# EasyEDA Pro project 2.8_pcb_src.eprj, board PCB1
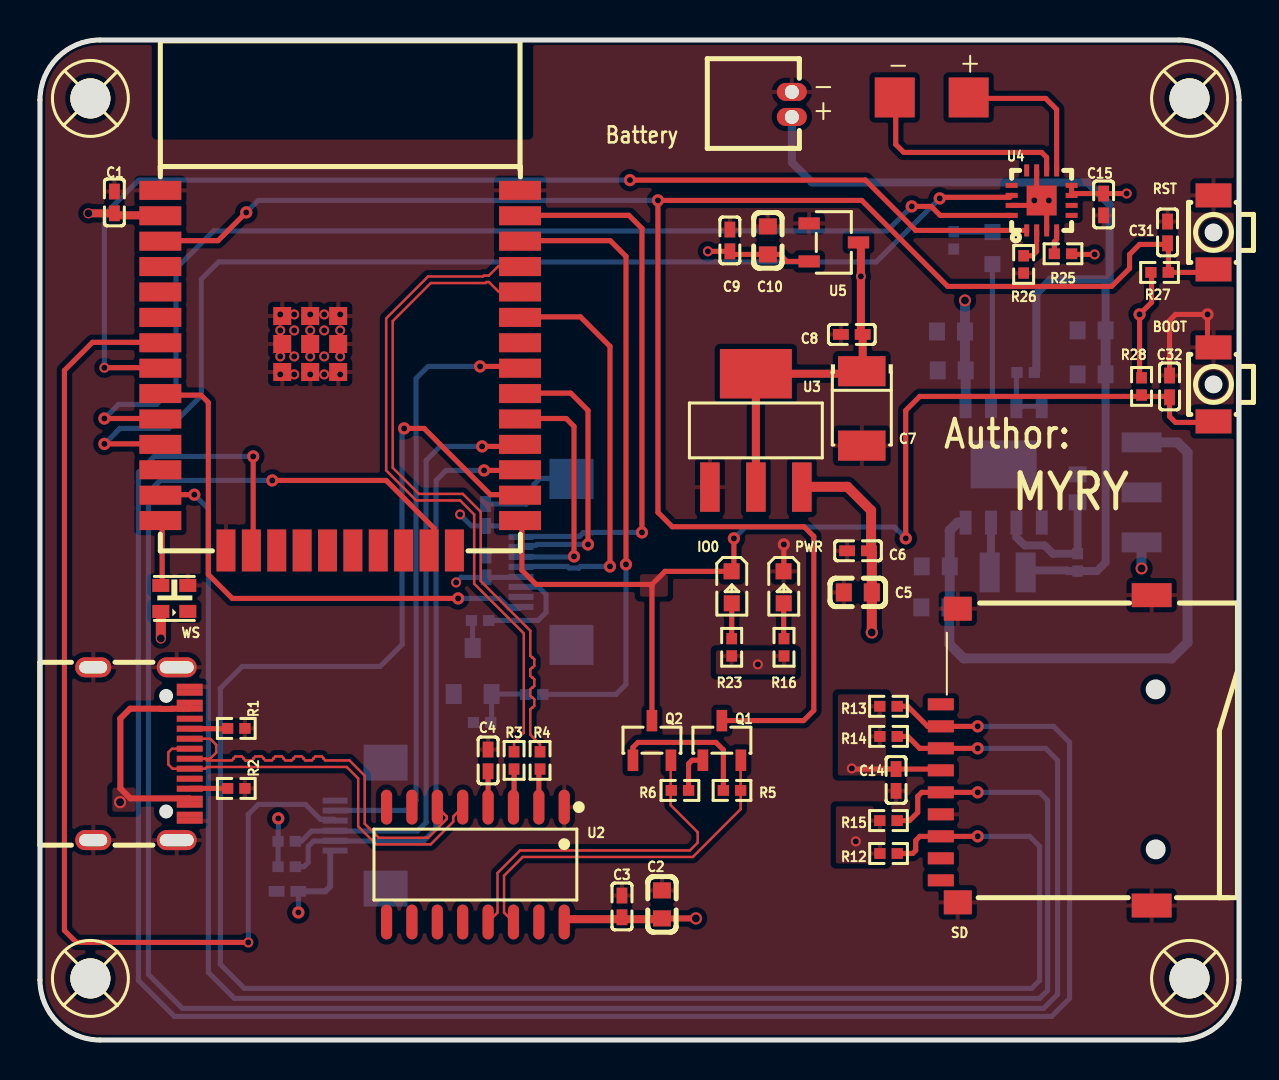
[diagram p2: board, top side]
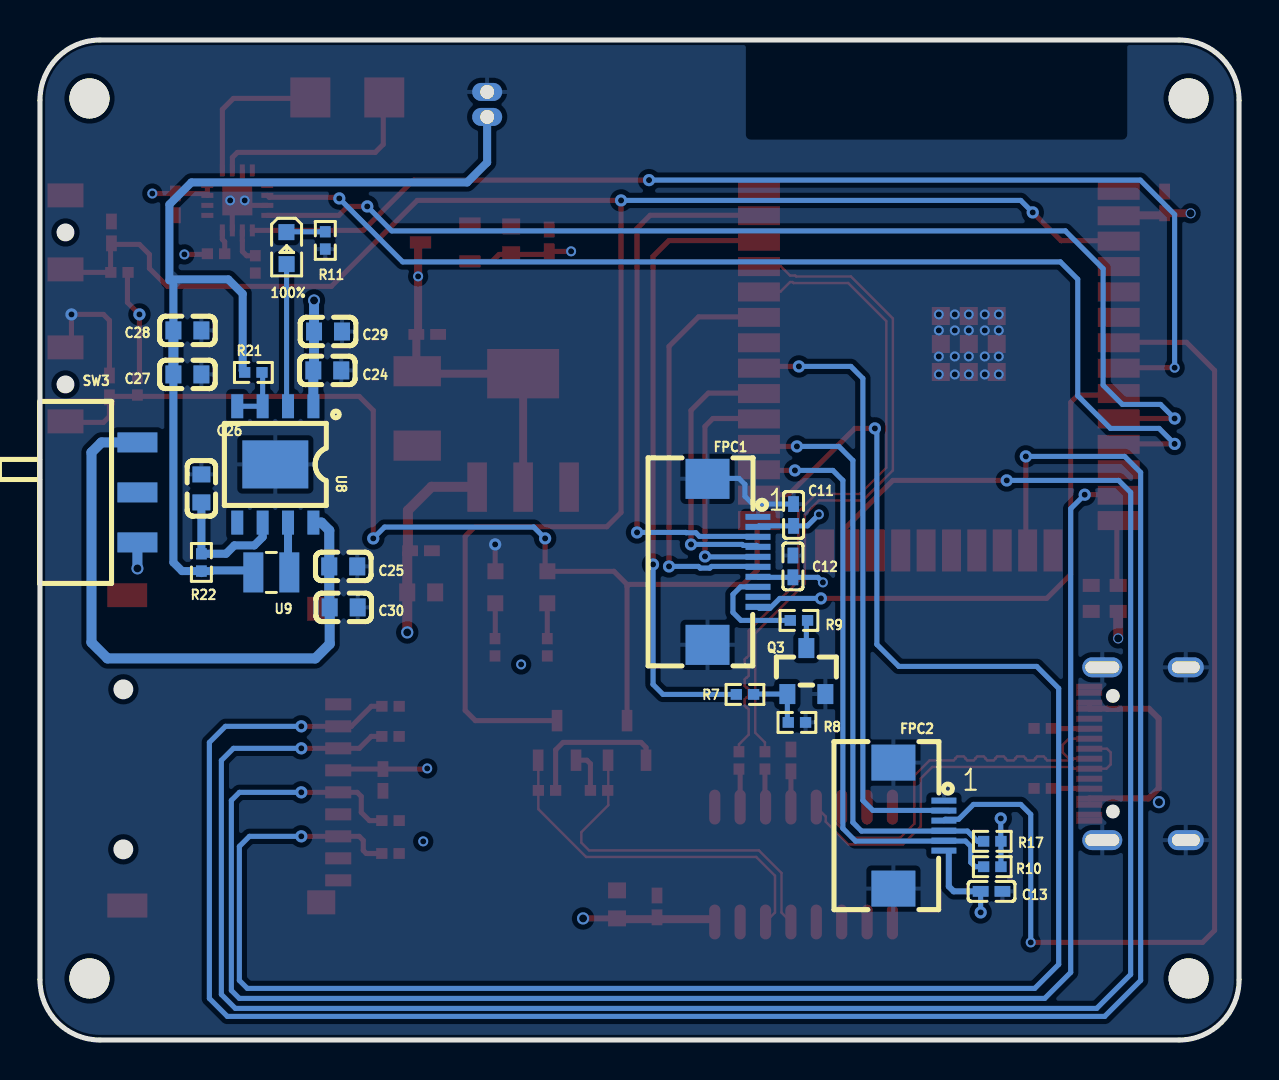
[diagram p3: board, bottom side, seen from below]

Outline 60 x 50 mm; copper layers: Top Layer, GND, PWR, Bottom Layer. Coordinates in mm from the lower left corner of the outline.
Outline path: 0,47 0,3 arc(0.88,0.88) 3,0 57,0 arc(59.12,0.88) 60,3 60,47 arc(59.12,49.12) 57,50 3,50 arc(0.88,49.12) 0,47
Stack: Top Layer 0.035mm Outer layer copper thickness 1oz / Dielectric1 0.2104mm 7628 RC49% 8.6mil / GND 0.0152mm Inner layer copper thickness / Dielectric2 1.065mm 1.1mm H/HOZ Copper / PWR 0.0152mm Inner layer copper thickness / Dielectric3 0.2104mm 7628 RC49% 8.6mil / Bottom Layer 0.035mm Outer layer copper thickness 1oz

## Design rules (mm)
net RTS: DP2
net DTR: DP2
net TX0: DP3
net RX0: DP3
net USB_DP: DP1
net USB_DN: DP1
template: Custom Config
spacing copperThickness1oz (default): track to track 0.102, other pairs 0.152 to 0.3
spacing copperThickness2oz: track to track 0.203, other pairs 0.152 to 0.3
track width copperThickness1oz (default): min 0.127, default 0.254, max 2.54
track width copperThickness2oz: min 0.203, default 0.254, max 2.54
differential pair differentialPair (default): width min 0.124, default 0.124, max 0.124; gap min 0.203, default 0.203
via viaSize (default): diameter min 0.5, default 0.61, max 10; hole min 0.3, default 0.305, max 6.3

## Placement (name value [footprint] x y rotation side)
100%  XL-1608SURC-06  [LED0603-RD_RED]  47.66 39.59 270 bottom
Battery  ZX-MX1.25-2PWZ  [CONN-TH_2P-P1.25_ZX-MX1.25-2PWZ]  37.62 46.78 270 top
BOOT  TS-1063S-B3D4  [KEY-SMD_L3.0-W2.5-LS4.0_TS-1603S]  58.72 32.78 90 top
C1  100nF  [C0402]  3.72 41.88 270 top
C2  10uF  [C0603]  31.12 6.78 270 top
C3  100nF  [C0402]  29.12 6.68 90 top
C4  100nF  [C0402]  22.42 13.98 270 top
C5  10uF  [C0603]  40.92 22.38 0 top
C6  100nF  [C0402]  40.93 24.46 180 top
C7  100uF  [CASE-B_3528]  41.12 31.58 270 top
C8  100nF  [C0402]  40.62 35.28 0 top
C9  100nF  [C0402]  34.52 39.98 270 top
C10  47uF  [C0603]  36.42 39.98 270 top
C11  100nF  [C0402]  22.29 26.25 90 bottom
C12  100nF  [C0402]  22.32 23.68 90 bottom
C13  100nF  [C0402]  12.38 7.43 180 bottom
C14  100nF  [C0402]  42.84 13 270 top
C15  100nF  [C0402]  53.22 41.78 270 top
C24  10uF  [C0603]  45.62 33.48 180 bottom
C25  10uF  [C0603]  44.82 23.68 180 bottom
C26  22uF  [C0603]  51.92 27.58 270 bottom
C27  22uF  [C0603]  52.62 33.28 180 bottom
C28  22uF  [C0603]  52.62 35.48 180 bottom
C29  22uF  [C0603]  45.59 35.43 0 bottom
C30  22uF  [C0603]  44.8 21.63 0 bottom
C31  100nF  [C0402]  56.42 40.38 270 top
C32  100nF  [C0402]  56.52 32.68 270 top
FPC1  0.5K-DX-10PWBG  [FPC-SMD_10P-P0.50_HDGC_0.5K-DX-10PWBG]  25.33 23.91 270 bottom
FPC2  0.5K-DX-6PWBG  [FPC-SMD_6P-P0.50_DEALON_0.5K-DX-6PWB]  16.03 10.72 270 bottom
IO0  XL-1608SURC-06  [LED0603-RD_RED]  34.61 22.64 270 top
PWR  XL-1608SURC-06  [LED0603-RD_RED]  37.21 22.64 270 top
Q1  S8050  [SOT-23-3_L2.9-W1.3-P1.90-LS2.3-BR]  34.12 14.98 270 top
Q2  S8050  [SOT-23-3_L2.9-W1.3-P1.90-LS2.3-BR]  30.62 14.98 270 top
Q3  Si2302CDS-T1-GE3  [SOT-23_L2.9-W1.3-P1.90-LS2.4-BR]  21.65 18.45 270 bottom
R1  5.1K  [R0402]  9.82 15.58 180 top
R2  5.1K  [R0402]  9.82 12.58 0 top
R3  5.1K  [R0402]  23.72 13.98 90 top
R4  5.1K  [R0402]  25.02 13.98 90 top
R5  12K  [R0402]  32.02 12.48 0 top
R6  12K  [R0402]  34.63 12.48 180 top
R7  1K  [R0402]  24.72 17.28 180 bottom
R8  10K  [R0402]  22.12 15.88 180 bottom
R9  10  [R0402]  22.02 20.98 0 bottom
R10  4.7K  [R0402]  12.35 8.66 0 bottom
R11  2K  [R0402]  45.72 39.98 90 bottom
R12  10K  [R0402]  42.46 9.33 180 top
R13  10K  [R0402]  42.46 16.69 180 top
R14  10K  [R0402]  42.46 15.18 180 top
R15  10K  [R0402]  42.46 10.97 180 top
R16  470  [R0402]  37.23 19.64 90 top
R17  4.7K  [R0402]  12.35 9.94 0 bottom
R21  1K  [R0402]  49.32 33.38 180 bottom
R22  1K  [R0402]  51.92 23.88 270 bottom
R23  470  [R0402]  34.61 19.64 90 top
R25  1M  [R0402]  51.19 39.31 0 top
R26  220  [R0402]  49.22 38.78 270 top
R27  10K  [R0402]  56.02 38.38 180 top
R28  10K  [R0402]  55.12 32.68 90 top
RST  TS-1063S-B3D4  [KEY-SMD_L3.0-W2.5-LS4.0_TS-1603S]  58.72 40.38 90 top
SCREW1  -  [Screw-Hole-M2]  2.52 3.08 0 top
SCREW2  -  [Screw-Hole-M2]  57.52 3.08 0 top
SCREW3  -  [Screw-Hole-M2]  2.52 47.08 0 top
SCREW4  -  [Screw-Hole-M2]  57.52 47.08 0 top
SD  TF-01A  [TF-SMD_TF-01A]  50.35 14.48 90 top
SW3  SK-3245S-L1-A  [SW-SMD_SK-3245S-L1-A-1]  55.12 27.38 90 bottom
TP1  -  [Test-Point-0.5mm]  42.77 47.13 0 top
TP2  -  [Test-Point-0.5mm]  46.47 47.13 0 top
U2  CH340C  [SOP-16_L10.0-W3.9-P1.27-LS6.0-BL]  21.79 8.77 180 top
U3  AMS1117-3.3  [SOT-223-4_L6.5-W3.5-P2.30-LS7.0-BR]  35.82 30.48 270 top
U4  MAX98357AETE+T  [TQFN-16_L3.0-W3.0-P0.50-BL-EP1.5]  50.12 41.98 0 top
U5  XC6206-2.8V  [SOT-23-3_L2.9-W1.6-P1.90-LS2.8-BR]  39.72 39.88 180 top
U8  IP5306  [ESOP-8_L4.9-W3.9-P1.27-LS6.0-BL-EP]  48.22 28.78 0 bottom
U9  1uH  [IND-SMD_L2.5-W2.0_YXNAQ252010-3R3M]  48.42 23.38 180 bottom
U11  ESP32-WROOM-32E-N16  [WIFI-SMD_ESP32-WROOM-32E]  15.02 33.48 270 top
USB1  KH-TYPE-C-16P  [USB-C-SMD_KH-TYPE-C-16P]  5.08 14.31 270 top
WS  XL-2020RGBC-WS2812B  [LED-SMD_4P-L2.0-W2.0-BR-1]  6.72 22.08 0 top

## Footprints (pads in the part's own frame, mm; a bottom-side part is the same pattern mirrored in y, then rotated)
C0402
  rect 0.79x0.54 smd: 1(-0.545,0) 2(0.545,0)
C0603
  rect 0.8x0.9 smd: 1(-0.7,0) 2(0.7,0)
CASE-B_3528
  rect 1.506x2.376 smd: 1(-1.861,0) 2(1.861,0)
CONN-TH_2P-P1.25_ZX-MX1.25-2PWZ
  oval 0.9x1.5 hole 0.7: 1(0.625,0) 2(-0.625,0)
ESOP-8_L4.9-W3.9-P1.27-LS6.0-BL-EP
  rect 0.6x1.2 smd: 1(-1.905,-2.909) 2(-0.635,-2.909) 3(0.635,-2.909) 4(1.905,-2.909) 5(1.905,2.909) 6(0.635,2.909) 7(-0.635,2.909) 8(-1.905,2.909)
  rect 3.3x2.4 smd: 9(0,0)
FPC-SMD_6P-P0.50_DEALON_0.5K-DX-6PWB
  rect 0.3x1.25 smd: 1(-1.25,1.262) 2(-0.75,1.262) 3(-0.25,1.262) 4(0.25,1.262) 5(0.75,1.262) 6(1.25,1.262)
  rect 1.8x2.2 smd: 7(3.15,-1.262) 8(-3.15,-1.262)
FPC-SMD_10P-P0.50_HDGC_0.5K-DX-10PWBG
  rect 0.3x1.25 smd: 1(-2.25,1.262) 2(-1.75,1.262) 3(-1.25,1.262) 4(-0.75,1.262) 5(-0.25,1.262) 6(0.25,1.262) 7(0.75,1.262) 8(1.25,1.262) 9(1.75,1.262) 10(2.25,1.262)
  rect 2x2.2 smd: 11(4.15,-1.262) 12(-4.15,-1.262)
IND-SMD_L2.5-W2.0_YXNAQ252010-3R3M
  rect 1x2 smd: 1(0.9,0) 2(-0.9,0)
KEY-SMD_L3.0-W2.5-LS4.0_TS-1603S
  rect 1.2x1.8 smd: 1(-1.85,0) 2(1.85,0)
LED0603-RD_RED
  rect 0.8x0.8 smd: 1(-0.799,-0.004) 2(0.799,0.004)
LED-SMD_4P-L2.0-W2.0-BR-1
  rect 0.85x0.65 smd: 1(0.675,-0.65) 2(0.675,0.65) 3(-0.675,0.65) 4(-0.675,-0.65)
R0402
  rect 0.566x0.54 smd: 1(-0.433,0) 2(0.433,0)
Screw-Hole-M2
  round 2 hole 2: 1(0,0)
SOP-16_L10.0-W3.9-P1.27-LS6.0-BL
  oval 0.56x1.745 smd: 1(-4.445,-2.873) 2(-3.175,-2.873) 3(-1.905,-2.873) 4(-0.635,-2.873) 5(0.635,-2.873) 6(1.905,-2.873) 7(3.175,-2.873) 8(4.445,-2.873) 9(4.445,2.873) 10(3.175,2.873) 11(1.905,2.873) 12(0.635,2.873) 13(-0.635,2.873) 14(-1.905,2.873) 15(-3.175,2.873) 16(-4.445,2.873)
SOT-23-3_L2.9-W1.3-P1.90-LS2.3-BR
  rect 1.07x0.532 smd: 1(0.99,-0.95) 2(0.99,0.95) 3(-0.99,0)
SOT-23-3_L2.9-W1.6-P1.90-LS2.8-BR
  rect 1.07x0.6 smd: 1(1.235,-0.95) 2(1.235,0.95) 3(-1.235,0)
SOT-23_L2.9-W1.3-P1.90-LS2.4-BR
  rect 1x0.8 smd: 1(1.15,-0.95) 2(1.15,0.95) 3(-1.15,0)
SOT-223-4_L6.5-W3.5-P2.30-LS7.0-BR
  rect 2.47x0.98 smd: 1(2.835,-2.3) 2(2.835,0) 3(2.835,2.3)
  rect 2.47x3.6 smd: 4(-2.835,0)
SW-SMD_SK-3245S-L1-A-1
  rect 1x2 smd: 1(-2.5,0) 2(0,0) 3(2.5,0)
Test-Point-0.5mm
  rect 2x2 smd: 1(0,0)
TF-SMD_TF-01A
  rect 0.6x1.3 smd: 1(2.3,5.276) 2(1.2,5.276) 3(0.101,5.276) 4(-1,5.276) 5(-2.099,5.276) 6(-3.2,5.276) 7(-4.3,5.276) 8(-5.399,5.276) 9(-6.5,5.276)
  rect 1.2x1.4 smd: 10(-7.599,4.426) 13(7.08,4.426)
  rect 1.2x2 smd: 11(-7.76,-5.276) 12(7.76,-5.276)
TQFN-16_L3.0-W3.0-P0.50-BL-EP1.5
  rect 0.25x0.6 smd: 1(-0.749,-1.5) 2(-0.248,-1.5) 3(0.252,-1.5) 4(0.751,-1.5) 9(0.75,1.5) 10(0.25,1.5) 11(-0.25,1.5) 12(-0.749,1.5)
  rect 0.6x0.25 smd: 5(1.5,-0.748) 6(1.5,-0.248) 7(1.5,0.252) 8(1.5,0.752) 13(-1.5,0.752) 14(-1.5,0.252) 15(-1.5,-0.248) 16(-1.5,-0.748)
  rect 1.5x1.5 smd: 17(0,0)
USB-C-SMD_KH-TYPE-C-16P
  oval 1x2 hole 0.6x1.7: 1(-4.32,1.765) 2(4.32,1.765)
  oval 1x1.8 hole 0.6x1.4: 3(-4.32,-2.415) 4(4.32,-2.415)
  rect 0.3x1.3 smd: A1(-3.35,2.415) A4(-2.55,2.415) A5(-1.25,2.415) A6(-0.25,2.415) A7(0.25,2.415) A8(1.25,2.415) A9(2.55,2.415) A12(3.35,2.415) B1(3.05,2.415) B4(2.25,2.415) B5(1.75,2.415) B6(0.75,2.415) B7(-0.75,2.415) B8(-1.75,2.415) B9(-2.25,2.415) B12(-3.05,2.415)
WIFI-SMD_ESP32-WROOM-32E
  rect 0.95x2.1 smd: 1(-9.002,-9) 2(-7.732,-9) 3(-6.463,-9) 4(-5.192,-9) 5(-3.922,-9) 6(-2.652,-9) 7(-1.383,-9) 8(-0.113,-9) 9(1.157,-9) 10(2.428,-9) 11(3.697,-9) 12(4.968,-9) 13(6.237,-9) 14(7.508,-9) 25(7.508,9) 26(6.237,9) 27(4.968,9) 28(3.697,9) 29(2.428,9) 30(1.157,9) 31(-0.113,9) 32(-1.383,9) 33(-2.652,9) 34(-3.922,9) 35(-5.192,9) 36(-6.463,9) 37(-7.732,9) 38(-9.002,9)
  rect 2.1x0.95 smd: 15(9.002,-5.715) 16(9.002,-4.445) 17(9.002,-3.175) 18(9.002,-1.905) 19(9.002,-0.635) 20(9.002,0.635) 21(9.002,1.905) 22(9.002,3.175) 23(9.002,4.445) 24(9.002,5.715)
  rect 0.9x0.9 smd: 39(-2.721,-0.1) 39(-2.721,-1.5) 39(-2.721,-2.9) 39(-1.321,-0.1) 39(-1.321,-1.5) 39(-1.321,-2.9) 39(0.079,-0.1) 39(0.079,-1.5) 39(0.079,-2.9)

## Nets
2.8V: C9.2 C10.2 C11.1 FPC1.2 U5.2
3V3: C1.2 C7.1 C8.2 C12.1 C13.1 C14.1 C15.1 FPC1.7 FPC2.6 R10.1 R12.2 R13.2 R14.2 R15.2 R16.1 R17.1 R23.1 R25.2 R27.2 R28.2 SD.4 U3.2 U3.4 U4.7 U4.8 U5.3 U11.2
5V: C2.2 C3.1 C5.2 C6.1 SW3.1 U2.16 U3.3 WS.4
GND: Battery.2 BOOT.2 C1.1 C2.1 C3.2 C4.1 C5.1 C6.2 C7.2 C8.1 C9.1 C10.1 C11.2 C12.2 C13.2 C14.2 C15.2 C24.2 C25.2 C26.1 C27.2 C28.2 C29.1 C30.1 C31.1 C32.1 FPC1.1 FPC1.11 FPC1.12 FPC2.1 FPC2.7 FPC2.8 PWR.1 Q3.2 R1.1 R2.2 R8.2 R11.1 R26.2 RST.2 SD.6 SD.10 SD.11 SD.12 SD.13 U2.1 U3.1 U4.3 U4.11 U4.15 U4.17 U5.1 U8.9 U11.1 U11.15 U11.38 U11.39 USB1.1 USB1.2 USB1.3 USB1.4 USB1.A1 USB1.A12 USB1.B1 USB1.B12 WS.2
BAT: Battery.1 C27.1 C28.1 R21.1 R22.2 U9.2
DTR: Q2.2 R5.1 U2.13
EN: C31.2 Q1.3 R27.1 RST.1 U11.3
IO0: BOOT.1 C32.2 IO0.1 Q2.3 R28.1 U11.25
IO4_SD_MISO: R12.1 SD.7 U11.26
IO5_LCD_CS: FPC1.5 U11.29
IO12_WS: U11.14 WS.3
IO13_SD_CS: R13.1 SD.2 U11.16
IO14_SD_SCK: R15.1 SD.5 U11.13
IO15_SD_MOSI: R14.1 SD.3 U11.23
IO16_TP_SCL: FPC2.5 R10.2 U11.27
IO17_TP_SDA: FPC2.4 R17.2 U11.28
IO18_LCD_SCK: FPC1.4 U11.30
IO19_TP_RST: FPC2.2 U11.31
IO22_LCD_BLK: R7.1 U11.36
IO23_LCD_MOSI: FPC1.3 U11.37
IO25_I2S_CLK: U4.16 U11.10
IO26_I2S_LRCLK: U4.14 U11.11
IO32_I2S_DIN: U4.1 U11.8
IO32_LCD_RS: FPC1.10 U11.9
IO33_LCD_RST: FPC1.6 U11.33
IO35_TP_INT: FPC2.3 U11.7
LEDK: FPC1.8 R9.2
RTS: Q1.2 R6.1 U2.14
RX0: R4.2 U11.34
TX0: R3.2 U11.35
USB_5V: C24.1 C29.2 U8.1 USB1.A4 USB1.A9 USB1.B4 USB1.B9
USB_DN: U2.6 USB1.A7 USB1.B7
USB_DP: U2.5 USB1.A6 USB1.B6
$1N3140: 100%.2 U8.2
$1N3141: 100%.1 R11.2
$1N3143: R21.2 U8.3 U8.4
$1N3146: C25.1 C30.2 SW3.3 U8.8
$1N3149: U8.7 U9.1
$1N3152: C26.2 R22.1 U8.6
$1N3676: R1.2 USB1.A5
$1N3681: R2.1 USB1.B5
$1N4120: R4.1 U2.2
$1N4125: R3.1 U2.3
$1N4154: C4.2 U2.4
$1N4327: Q1.1 R5.2
$1N4331: Q2.1 R6.2
$1N5555: Q3.1 R7.2 R8.1
$1N5650: Q3.3 R9.1
$1N6795: TP1.1 U4.10
$1N6801: TP2.1 U4.9
$1N6935: IO0.2 R23.2
$1N6977: PWR.2 R16.2
$1N11841: R25.1 U4.4
$1N11888: R26.1 U4.2

Pads without a net: FPC1 9; SCREW1 1; SCREW2 1; SCREW3 1; SCREW4 1; SD 1 8 9; SW3 2; U2 7 8 9 10 11 12 15; U4 5 6 12 13; U8 5; U11 4 5 6 12 17 18 19 20 21 22 24 32; USB1 A8 B8; WS 1

## Via types
v1: diameter 0.5, hole 0.305, Top Layer to Bottom Layer, 32 vias
v2: diameter 0.61, hole 0.305, Top Layer to Bottom Layer, 31 vias
v3: diameter 0.5, hole 0.4, Top Layer to Bottom Layer, 2 vias
v4: diameter 0.61, hole 0.4, Top Layer to Bottom Layer, 3 vias
v5: diameter 0.6, hole 0.4, Top Layer to Bottom Layer, 2 vias
v6: diameter 0.5, hole 0.3, Top Layer to Bottom Layer, 1 via

## Routing (per net, layer and track width the routed paths; a pad name or vN(x,y) marks a point on that pad's centre or on a via; arc(x,y) is an arc through that point)
2.8V: length 33.7
  Top Layer w0.254: U5.2 37.37,38.93 37.02,39.28 C10.2 34.68,39.28 C9.2 v1(33.42,39.43)
  PWR w0.254: v6(21.02,26.28) 21.02,38.68 21.78,39.43 v1(33.42,39.43)
  Bottom Layer w0.254: v6(21.02,26.28) 21.6,25.71 C11.1 24.02,25.71 FPC1.2
3V3: length 237.6
  Top Layer w0.254: R27.2 55.62,38.35 55.62,36.88 v2(55.02,36.28) 55.02,33.21 R28.2 ; v1(54.38,42.32) C15.1 51.72,42.32 U4.7 U4.8 ; v1(52.77,39.28) 51.66,39.28 ; SD.4 45.01,13.55 C14.1 40.65,13.55 v1(40.62,13.58)
  Top Layer w0.4: U3.2 U3.4 41,33.31 C7.1 41.17,33.48 C8.2 41.08,35.37 v1(41.08,38.18) 41.08,39.76 U5.3 ; v3(2.42,41.33) C1.2 3.82,41.23 6.11,41.23
  PWR w0.254: v1(52.77,39.28) 53.72,39.28 54.38,39.93 v1(54.38,42.32) ; v1(35.92,18.78) 35.92,37.48 36.62,38.18 v1(41.08,38.18) 43.02,38.18 45.32,35.88 54.62,35.88 v2(55.02,36.28) 55.02,41.68 v1(54.38,42.32) ; v1(35.92,18.78) 35.92,14.48 36.82,13.58 v1(40.62,13.58) ; v1(35.92,18.78) 35.82,18.68 33.22,18.68 32.72,19.18 32.72,21.88 31.72,22.88 v1(20.82,22.88) 13.92,22.88 11.92,20.88 v2(11.92,11.08) ; v2(11.92,11.08) 10.22,11.08 9.62,10.48 9.62,7.18 10.42,6.38 v2(12.93,6.38) ; v2(11.92,11.08) 39.67,11.08 v1(40.82,9.93) ; v3(2.42,41.33) 2.42,43.18 3.32,44.08 53.62,44.08 54.42,43.28 54.42,42.37 v1(54.38,42.32)
  Bottom Layer w0.254: FPC1.7 24.05,23.13 C12.1 21.08,23.13 v1(20.82,22.88) ; v2(11.92,11.08) 11.92,9.94 R17.1 R10.1 ; C13.1 v2(12.93,6.38)
  Bottom Layer w0.3: C13.1 14.28,7.43 14.52,7.68 14.52,9.44 14.51,9.45
5V: length 106.3
  Top Layer w0.3: C2.2 v4(32.82,6.08)
  Top Layer w0.4: 31.12,6.04 26.37,6.04 U2.16
  Top Layer w0.5: v4(41.62,20.38) C5.2 41.62,24.32 C6.1 41.59,24.57 41.59,26.48 40.41,27.66 38.14,27.66 U3.3 ; WS.4 v3(6.05,20.08)
  PWR w0.5: v3(6.05,20.08) 4.92,18.95 4.92,3.48 6.02,2.38 31.52,2.38 32.82,3.68 v4(32.82,6.08) 39.82,6.08 41.62,7.88 v4(41.62,20.38) 54.72,20.38 55.12,20.78 v5(55.12,23.58)
  Bottom Layer w0.5: SW3.1 v5(55.12,23.58)
GND: length 17.6
  Top Layer w0.254: v2(37.22,24.78) 37.22,23.45 PWR.1 ; C32.1 56.52,35.98 56.82,36.28 v2(58.42,36.28) 58.42,34.93 BOOT.2 ; U4.15 49.51,41.73 v1(49.76,41.98) ; U4.11 49.87,42.59 v1(50.48,41.98) 50.37,41.87 U4.3
  Bottom Layer w0.254: C11.2 24.34,26.8 24.72,27.18 24.72,27.78 25.02,28.08 26.58,28.08 26.6,28.06
  vias: v1(12.02,36.28) v1(12.02,35.48) v1(12.02,34.18) v1(12.02,33.28) v1(12.72,36.28) v1(12.72,35.48) v1(12.72,34.18) v1(12.72,33.28) v1(13.52,36.28) v1(13.52,35.48) v1(13.52,34.18) v1(13.52,33.28) v1(14.22,36.28) v1(14.22,35.48) v1(14.22,34.18) v1(14.22,33.28) v1(15.02,36.28) v1(15.02,35.48) v1(15.02,34.18) v1(15.02,33.28)
BAT: length 49
  Bottom Layer w0.4: R21.1 49.86,33.48 49.86,37.31 50.57,38.03 53.48,38.03 53.52,37.98 53.52,41.78 52.42,42.88 38.62,42.88 37.62,43.88 Battery.1 ; 53.32,37.89 C28.1 ; C27.1 53.32,23.88 52.89,23.45 R22.2 ; 51.87,23.4 51.92,23.35 ; 51.82,23.45 51.42,23.45 51.39,23.48 49.42,23.48 U9.2
  Bottom Layer w0.5: C28.1 C27.1
DTR: length 18
  Top Layer w0.124: U2.13 22.89,6.37 22.89,8.35 24.02,9.48 32.52,9.48 32.91,9.87 32.91,10.39 31.56,11.74 31.56,13.98 Q2.2
EN: length 95.4
  Top Layer w0.254: 6.11,39.97 8.91,39.97 v2(10.32,41.38) ; 58.82,38.53 58.67,38.38 56.47,38.38 56.47,39.73 56.42,39.78 55.02,39.78 54.52,39.28 54.52,38.58 53.62,37.68 45.42,37.68 41.12,41.98 v2(30.92,41.98) 30.92,26.38 31.64,25.66 38.24,25.66 38.72,25.18 38.72,16.48 38.21,15.97 Q1.3
  Bottom Layer w0.254: v2(10.32,41.38) 10.92,41.98 v2(30.92,41.98)
IO0: length 54.4
  Top Layer w0.254: v2(43.32,25.08) 43.32,31.48 44.02,32.18 56.48,32.18 C32.2 56.52,31.18 56.82,30.88 58.67,30.88 BOOT.1 ; v2(34.72,25.08) 34.72,23.55 IO0.1 31.28,23.43 30.62,22.78 30.62,22.68 ; 30.62,22.68 30.52,22.78 24.82,22.78 24.11,23.49 24.11,26 ; 30.62,22.68 Q2.3
  Bottom Layer w0.254: v2(43.32,25.08) 42.76,25.65 35.29,25.65 v2(34.72,25.08)
IO4_SD_MISO: length 98.3
  Top Layer w0.254: v2(18.22,30.58) 19.22,30.58 22.54,27.27 24.11,27.27 ; v2(46.92,10.18) SD.7 44.03,10.18 43.82,9.98 43.82,9.48 43.67,9.33 R12.1
  Bottom Layer w0.254: v2(18.22,30.58) 18.12,30.48 18.12,19.78 17.02,18.68 10.12,18.68 9.02,17.58 9.02,3.78 10.22,2.58 49.62,2.58 50.02,2.98 50.02,9.68 49.52,10.18 v2(46.92,10.18)
IO5_LCD_CS: length 11.9
  Top Layer w0.254: v2(26.72,24.18) 26.72,30.68 26.33,31.08 24.11,31.08
  Bottom Layer w0.254: v2(26.72,24.18) 26.7,24.16 FPC1.5
IO12_WS: length 3.3
  Top Layer w0.254: 5.95,22.73 6.11,22.89 6.11,26
IO13_SD_CS: length 106.1
  Top Layer w0.254: R13.1 43.42,16.69 44.42,15.68 SD.2 v2(46.92,15.68) ; v2(10.67,29.18) 10.67,24.47
  Bottom Layer w0.254: v2(46.92,15.68) 50.72,15.68 51.52,14.88 51.52,2.08 50.62,1.18 6.72,1.18 4.92,2.98 4.92,28.38 5.72,29.18 v2(10.67,29.18)
IO14_SD_SCK: length 86.7
  Top Layer w0.254: v2(46.92,12.38) SD.5 44.13,12.38 43.92,12.18 43.92,11.38 43.51,10.97 R15.1 ; 6.11,27.27 v2(7.72,27.27)
  Bottom Layer w0.254: v2(7.72,27.27) 8.42,26.56 8.42,3.38 9.72,2.08 50.02,2.08 50.42,2.48 50.42,11.98 50.02,12.38 v2(46.92,12.38)
IO15_SD_MOSI: length 107.5
  Top Layer w0.254: R14.1 43.42,15.18 44.02,14.58 SD.3 v2(46.92,14.58) ; 19.56,24.47 19.72,24.64 19.72,25.58 17.32,27.98 v2(11.62,27.98)
  Bottom Layer w0.254: v2(46.92,14.58) 50.32,14.58 50.92,13.98 50.92,2.28 50.22,1.58 7.12,1.58 5.42,3.28 5.42,27.38 6.02,27.98 v2(11.62,27.98)
IO16_TP_SCL: length 30.2
  Top Layer w0.254: 24.11,28.53 24.06,28.48 v2(22.22,28.48)
  Bottom Layer w0.254: R10.2 13.21,8.66 13.42,8.88 13.42,9.68 13.69,9.95 19.19,9.95 19.82,10.58 19.82,27.98 20.32,28.48 v2(22.22,28.48)
IO17_TP_SDA: length 30.2
  Top Layer w0.254: v2(22.12,29.68) 23.99,29.68 24.11,29.8
  Bottom Layer w0.254: R17.2 13.08,9.94 13.59,10.45 18.89,10.45 19.32,10.88 19.32,28.98 20.02,29.68 v2(22.12,29.68)
IO18_LCD_SCK: length 13.8
  Top Layer w0.254: v2(27.42,24.78) 27.42,31.48 26.56,32.34 24.11,32.34
  Bottom Layer w0.254: FPC1.4 24.14,24.73 24.81,24.73 24.86,24.78 v2(27.42,24.78)
IO19_TP_RST: length 31.2
  Top Layer w0.254: v2(22.02,33.68) 24.05,33.68 24.11,33.61
  Bottom Layer w0.254: v2(22.02,33.68) 19.42,33.68 18.82,33.08 18.82,11.98 18.32,11.48 14.55,11.48 14.51,11.45
IO22_LCD_BLK: length 31.3
  Top Layer w0.254: 24.11,39.97 28.54,39.97 29.32,39.18 v2(29.32,23.78)
  Bottom Layer w0.254: R7.1 28.82,17.28 29.32,17.78 v2(29.32,23.78)
IO23_LCD_MOSI: length 27.6
  Top Layer w0.254: 24.11,41.23 29.47,41.23 30.12,40.58 v2(30.12,25.38)
  Bottom Layer w0.254: v2(30.12,25.38) 27.68,25.38 27.67,25.36 27.18,25.36 27,25.18 24.09,25.18 FPC1.3
IO25_I2S_CLK: length 56.3
  Top Layer w0.254: v2(43.62,41.68) 44.6,41.68 45.05,41.23 U4.16 ; 6.11,31.08 v2(3.22,31.08)
  Bottom Layer w0.254: v2(43.62,41.68) 42.4,40.45 8.69,40.45 6.8,38.57 6.8,32.74 5.84,31.78 3.93,31.78 v2(3.22,31.08)
IO26_I2S_LRCLK: length 56.8
  Top Layer w0.254: 6.11,29.8 v2(3.22,29.8) ; U4.14 48.53,42.14 45.08,42.14 v2(45.02,42.08)
  Bottom Layer w0.254: v2(3.22,29.8) 4,30.58 6.43,30.58 8.07,32.22 8.07,38.04 8.94,38.91 41.85,38.91 v2(45.02,42.08)
IO32_I2S_DIN: length 58.5
  Top Layer w0.254: 6.11,33.61 v1(3.22,33.61) ; U4.1 43.82,40.48 41.31,43 v2(29.52,43)
  Bottom Layer w0.254: v2(29.52,43) 4.94,43 3.22,41.28 v1(3.22,33.61)
IO32_LCD_RS: length 27.5
  Top Layer w0.254: v2(20.92,22.08) 9.62,22.08 8.42,23.28 8.42,31.88 8.06,32.25 6.21,32.25 6.11,32.34
  Bottom Layer w0.254: FPC1.10 23.99,21.58 23.48,21.58 22.98,22.08 v2(20.92,22.08)
IO33_LCD_RST: length 20.6
  Top Layer w0.254: 24.11,36.16 27.05,36.16 28.52,34.68 v2(28.52,23.68)
  Bottom Layer w0.254: FPC1.6 24.09,23.68 26.4,23.68 26.48,23.59 26.96,23.59 27.05,23.68 v2(28.52,23.68)
IO35_TP_INT: length 54.2
  Top Layer w0.254: 6.11,34.89 2.63,34.89 1.22,33.48 1.22,5.48 1.82,4.88 v1(10.42,4.88)
  Bottom Layer w0.254: FPC2.3 14.7,11.04 14.03,11.04 13.29,11.78 10.92,11.78 10.42,11.28 v1(10.42,4.88)
LEDK: length 5.3
  Bottom Layer w0.254: R9.2 24.92,20.98 25.32,21.38 25.32,22.28 24.94,22.66 FPC1.8
RTS: length 18.2
  Top Layer w0.124: Q1.2 35.06,13.98 R6.1 35.06,11.54 32.67,9.15 24.16,9.15 23.22,8.22 23.22,6.37 U2.14
RX0: length 33.9
  Top Layer w0.124: 24.11,37.42 22.94,37.42 22.47,37.9 22.34,37.9 22.29,37.85 19.55,37.85 17.65,35.94 17.65,28.61 18.96,27.31 21.16,27.31 22.05,26.41 22.05,22.95 24.54,20.47 24.54,19.21 24.62,19.12 24.65,19.12 24.74,19.03 24.74,18.71 24.65,18.62 24.62,18.62 24.54,18.53 24.54,18.21 24.62,18.12 24.65,18.12 24.74,18.03 24.74,17.71 24.65,17.62 24.62,17.62 24.54,17.53 24.54,17.21 24.62,17.12 24.65,17.12 24.74,17.03 24.74,16.71 24.65,16.62 24.62,16.62 24.54,16.53 24.54,15.27 25.02,14.78 R4.2
TX0: length 33.9
  Top Layer w0.124: 24.11,38.69 22.94,38.69 22.47,38.22 22.21,38.22 22.16,38.17 19.42,38.17 17.32,36.08 17.32,28.48 18.82,26.98 21.02,26.98 21.73,26.28 21.73,22.81 24.21,20.33 24.21,15.37 23.72,14.88 R3.2
USB_5V: length 89.7
  Top Layer w0.254: USB1.A4 USB1.B9
  Top Layer w0.3: USB1.B9 6.59,16.56 6.58,16.55 6.04,16.55 6.03,16.56 4.51,16.56 4.02,16.08 4.02,12.58 4.52,12.08 7.48,12.08 USB1.B4
  PWR w0.5: v5(46.29,36.98) 46.29,39.88 45.79,40.38 5.12,40.38 4.01,39.26 v4(4.01,11.89)
  Bottom Layer w0.5: U8.1 46.32,31.69 C24.1 46.29,33.52 C29.2 v5(46.29,36.98)
USB_DN: length 20.6
  Top Layer w0.124: U2.6 20.35,11.17 20.35,11.05 19.41,10.11 16.95,10.11 16.25,10.81 16.25,13.21 15.49,13.98 14.28,13.98 14.19,14.07 14.19,14.09 14.1,14.18 13.78,14.18 13.69,14.09 13.69,14.07 13.6,13.98 13.28,13.98 13.19,14.07 13.19,14.09 13.1,14.18 12.78,14.18 12.69,14.09 12.69,14.07 12.6,13.98 12.28,13.98 12.19,14.07 12.19,14.09 12.1,14.18 11.78,14.18 11.69,14.09 11.69,14.07 11.6,13.98 11.28,13.98 11.19,14.07 11.19,14.09 11.1,14.18 10.78,14.18 10.69,14.09 10.69,14.07 10.6,13.98 10.28,13.98 10.19,14.07 10.19,14.09 10.1,14.18 9.78,14.18 9.69,14.09 9.69,14.07 9.6,13.98 8.35,13.98 8.27,14.06 ; USB1.B7 8.51,15.06 8.82,14.75 8.82,14.38 8.51,14.06 8.27,14.06 ; 8.27,14.06 USB1.A7
USB_DP: length 20.5
  Top Layer w0.124: U2.5 20.68,11.17 20.68,10.91 19.55,9.78 16.82,9.78 15.92,10.68 15.92,13.08 15.35,13.65 8.35,13.65 8.27,13.56 USB1.B6 6.64,13.56 6.42,13.78 6.42,14.38 6.61,14.56 USB1.A6
$1N3140: length 7.1
  Bottom Layer w0.254: U8.2 47.66,31.76 100%.2
$1N3141: length 2
  Bottom Layer w0.254: R11.2 47.65,40.41 100%.1
$1N3143: length 3.1
  Bottom Layer w0.254: 48.99,33.38 48.92,33.38 48.86,33.31 U8.3 U8.4
$1N3146: length 31.3
  Bottom Layer w0.5: U8.8 45.91,25.87 45.52,25.48 C25.1 45.52,21.65 C30.2 45.5,19.8 46.22,19.08 56.62,19.08 57.42,19.88 57.42,29.38 56.92,29.88 55.32,29.88 55.12,30.08
$1N3149: length 2.5
  Bottom Layer w0.4: U9.1 47.59,23.44 U8.7
$1N3152: length 6.7
  Bottom Layer w0.4: U8.6 48.86,25.14 49.27,24.73 50.27,24.73 50.69,24.31 R22.1 C26.2
$1N3676: length 1.9
  Top Layer w0.254: R1.2 9.38,15.56 USB1.A5
$1N3681: length 1.9
  Top Layer w0.254: USB1.B5 7.51,12.58 R2.1
$1N4120: length 1.9
  Top Layer w0.254: 24.92,13.55 24.96,13.51 U2.2
$1N4125: length 1.9
  Top Layer w0.254: U2.3 23.72,11.68 R3.1
$1N4154: length 1.8
  Top Layer w0.254: C4.2 U2.4
$1N4327: length 2.1
  Top Layer w0.254: Q1.1 32.63,13.99 32.46,13.81 R5.2
$1N4331: length 7.4
  Top Layer w0.254: Q2.1 29.67,14.63 29.92,14.88 33.82,14.88 34.2,14.51 R6.2
$1N5555: length 3.1
  Bottom Layer w0.254: R7.2 24.27,17.3 Q3.1 22.6,15.92 R8.1
$1N5650: length 1.4
  Bottom Layer w0.254: R9.1 21.65,20.92 Q3.3
$1N6795: length 10.8
  Top Layer w0.254: U4.10 50.37,44.13 50.12,44.38 43.22,44.38 42.82,44.78 42.82,47.08
$1N6801: length 7.6
  Top Layer w0.254: U4.9 50.87,46.53 50.32,47.08 46.52,47.08
$1N6935: length 1.8
  Top Layer w0.254: 34.61,20.07 34.62,20.07 IO0.2
$1N6977: length 1.8
  Top Layer w0.254: PWR.2 37.22,20.08 37.23,20.07
$1N11841: length 1.2
  Top Layer w0.254: R25.1 50.76,39.91 50.87,40.03 U4.4
$1N11888: length 1.8
  Top Layer w0.254: U4.2 49.87,39.97 49.87,39.96 49.87,39.43 49.66,39.21 R26.1

## Copper pours and planes (outline as drawn; the poured copper is in the pictures)
3V3 on Top Layer: 33.82,19.48 37.82,19.48 37.82,18.28 33.82,18.28
3V3 on Top Layer: 39.82,11.68 42.34,11.68 42.34,8.83 39.82,8.83
3V3 on Top Layer: 39.92,17.28 42.34,17.28 42.34,13.23 39.92,13.23
GND on Top Layer: -0.78,53.78 66.12,53.78 66.12,-4.12 -0.78,-4.12
GND on Bottom Layer: -3.08,53.68 61.92,53.68 61.92,-3.92 -3.08,-3.92
GND on GND: -4.38,53.58 63.12,53.58 63.12,-3.52 -4.38,-3.52
GND on PWR: -3.08,52.58 64.62,52.58 64.62,-2.22 -3.08,-2.22
IO0 on Top Layer: 30.02,23.28 31.32,23.28 31.32,22.18 30.02,22.18
IO0 on Top Layer: 30.02,23.28 31.42,23.28 31.42,22.18 30.02,22.18
USB_5V on Top Layer: 3.62,12.62 3.62,11.41 4.79,11.41 4.79,12.63 4.34,12.62

Small or netless copper shapes (teardrops, artwork), in the pictures only: 1 on Bottom Layer

## Text on the board
Bottom Silkscreen Layer: 1
Top Silkscreen Layer: Battery | - | + | Author: | MYRY
